# EAGLE schematic sender_einfach_20v (EAGLE 7.1.0)
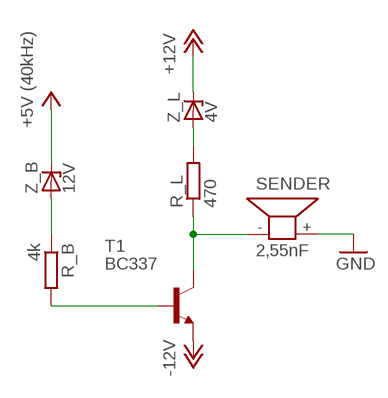
[diagram p0: schematic, sheet 1]

## Parts
R_B  4k  R-EU_0309/12  [0309/12]
R_L  470  R-EU_0309/12  [0309/12]
SENDER  2,55nF  AL11P  [AL11P]
T1  BC337  [TO92]
Z_B  12V  ZENER-DIODEDO41Z10  [DO41Z10]
Z_L  4V  ZENER-DIODEDO41Z10  [DO41Z10]

## Nets
+5V: Z_B.C ; supply symbol labelled +5V (40kHz)
+12V: Z_L.C
GND: SENDER.+ T1.1(E) ; supply symbol labelled -12V
N$1: R_B.2 T1.2(B)
N$2: R_L.2 Z_L.A
PWM: R_B.1 Z_B.A
R_L: R_L.1 SENDER.- T1.3(C)

## Library data of the parts
R_B R_L = rcl:R-EU_: RESISTOR, European symbol
SENDER = buzzer:AL11P: SPEAKER Source: Buerklin; OC_FARNELL: unknown; OC_NEWARK: unknown
T1 = transistor:BC337: NPN TRANSISTOR
Z_B Z_L = diode:ZENER-DIODE: Z-Diode